# Altium project Inclinometer.PrjPcb
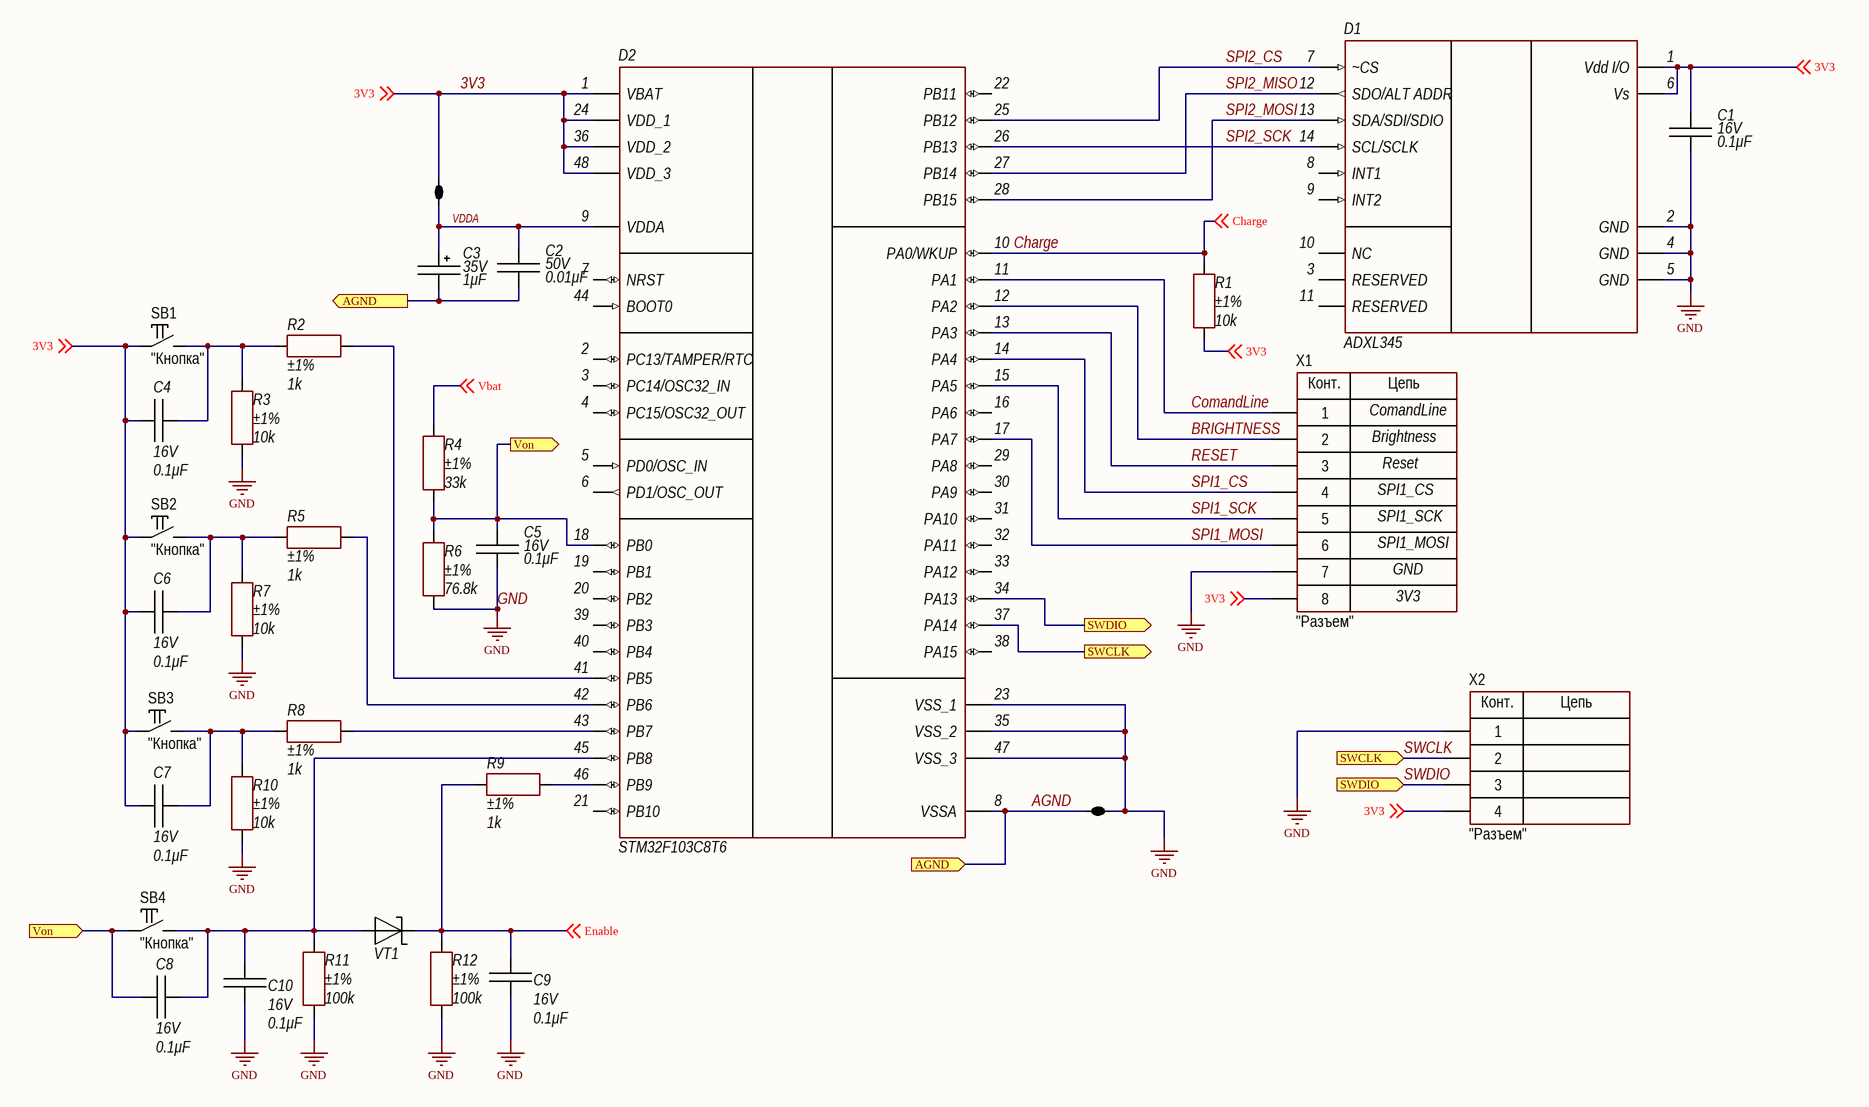
[diagram p0: InclinometerMain.SchDoc]
3 sheets, 52 parts. Net scope: flat (ports and power ports of the same name join across sheets).
Board file: Inclinometer.PcbDoc
Sheets:
  InclinometerMain.SchDoc
  InclinometerPower.SchDoc
  InclinometerDisplay.SchDoc

## Sheet InclinometerMain.SchDoc
size 420 x 297 mm; Address1: Address1; Address2: Address2; Address3: Address3; Address4: Address4; DocumentNumber: АБВГ.123456.001 Э3; SheetNumber: 1; Scale: 1:1; DocumentType: Схема электрическая принципиальная; FirstReferrence: АБВГ.123456.001

### Parts
C1  value 0.1μF  Voltage: 16V  [CAP: 0603]
C2  value 0.01μF  Voltage: 50V  [CAP: 0603]
C3  value 1μF  Voltage: 35V  [CAP: TANTAL-A]
C4  value 0.1μF  Voltage: 16V  [CAP: 0603]
C5  value 0.1μF  Voltage: 16V  [CAP: 0603]
C6  value 0.1μF  Voltage: 16V  [CAP: 0603]
C7  value 0.1μF  Voltage: 16V  [CAP: 0603]
C8  value 0.1μF  Voltage: 16V  [CAP: 0603]
C9  value 0.1μF  Voltage: 16V  [CAP: 0603]
C10  value 0.1μF  Voltage: 16V  [CAP: 0603]
D1  ADXL345  [ADXL345]
D2  STM32F103C8T6  [LQFP48]
J1  2 way net tie junction  [2way_MP]  (value not drawn)  (net tie, no BOM)
J2  2 way net tie junction  [2way_MP]  (value not drawn)  (net tie, no BOM)
R1  value 10k  Tolerance: ±1%  [RES: 0603]
R2  value 1k  Tolerance: ±1%  [RES: 0603]
R3  value 10k  Tolerance: ±1%  [RES: 0603]
R4  value 33k  Tolerance: ±1%  [RES: 0603]
R5  value 1k  Tolerance: ±1%  [RES: 0603]
R6  value 76.8k  Tolerance: ±1%  [RES: 0603]
R7  value 10k  Tolerance: ±1%  [RES: 0603]
R8  value 1k  Tolerance: ±1%  [RES: 0603]
R9  value 1k  Tolerance: ±1%  [RES: 0603]  (hidden comment: Resistor film, 2k, ±1%, 0603, 0.1W, -55...+155°C)
R10  value 10k  Tolerance: ±1%  [RES: 0603]
R11  value 100k  Tolerance: ±1%  [RES: 0603]  (hidden comment: Resistor film, 100k, ±5%, 0603, 0.1W, -55...+155°C)
R12  value 100k  Tolerance: ±1%  [RES: 0603]  (hidden comment: Resistor film, 1M, ±5%, 0603, 0.1W, -55...+155°C)
SB1  CommentText: "Кнопка"  [BUT: 6x6]
SB2  CommentText: "Кнопка"  [BUT: 6x6]
SB3  CommentText: "Кнопка"  [BUT: 6x6]
SB4  CommentText: "Кнопка"  [BUT: 6x6]
VT1  MOSFET P-channel transistor, -20V, -2.8A, 7.7nC, 4.16W, 58mOhm, 744pF, SOT23, -55...+150°C  [SOT23]  (value not drawn)
X1  CommentText: "Разъем"  [CON: PBS-8]
X2  CommentText: "Разъем"  [CON: PLS-4]

### Ports
AGND (in), AGND (out), SWCLK (in), SWCLK (out), SWDIO (in), SWDIO (out), Von (in), Von (out)

### Nets
GND: C1.1 C5.1 C9.1 C10.1 D1.2(GND) D1.4(GND) D1.5(GND) D2.23(VSS_1) D2.35(VSS_2) D2.47(VSS_3) J2.2 R3.1 R6.1 R7.1 R10.1 R11.2 R12.1 X1.7 X2.1
3V3: C1.2 C4.1 C6.1 C7.1 D1.1(Vdd_I/O) D1.6(Vs) D2.1(VBAT) D2.24(VDD_1) D2.36(VDD_2) D2.48(VDD_3) J1.1 R1.1 SB1.1 SB2.1 SB3.1 X1.8 X2.4 ; off-sheet 3V3
AGND: C2.1 C3.2 D2.8(VSSA) J2.1 ; port AGND
BRIGHTNESS: D2.12(PA2) X1.2
Charge: D2.10(PA0/WKUP) R1.2 ; off-sheet Charge
ComandLine: D2.11(PA1) X1.1
Enable: C9.2 R9.1 R12.2 VT1.3 ; off-sheet Enable
RESET: D2.13(PA3) X1.3
SPI1_CS: D2.14(PA4) X1.4
SPI1_MOSI: D2.17(PA7) X1.6
SPI1_SCK: D2.15(PA5) X1.5
SPI2_CS: D1.7(~CS) D2.25(PB12)
SPI2_MISO: D1.12(SDO/ALT_ADDR) D2.27(PB14)
SPI2_MOSI: D1.13(SDA/SDI/SDIO) D2.28(PB15)
SPI2_SCK: D1.14(SCL/SCLK) D2.26(PB13)
SWCLK: D2.37(PA14) X2.2 ; port SWCLK
SWDIO: D2.34(PA13) X2.3 ; port SWDIO
Vbat: R4.2 ; off-sheet Vbat
VDDA: C2.2 C3.1 D2.9(VDDA) J1.2
NetC4_2: C4.2 R2.1 R3.2 SB1.2
NetC5_2: C5.2 C8.1 D2.18(PB0) R4.1 R6.2 SB4.1 ; port Von
NetC6_2: C6.2 R5.1 R7.2 SB2.2
NetC7_2: C7.2 R8.1 R10.2 SB3.2
NetC8_2: C8.2 C10.2 D2.45(PB8) R11.1 SB4.2 VT1.1
NetD2_41: D2.41(PB5) R2.2
NetD2_42: D2.42(PB6) R5.2
NetD2_43: D2.43(PB7) R8.2
NetD2_46: D2.46(PB9) R9.2

Not connected (* = marked no-connect by the designer): D1 3(RESERVED) 8(INT1) 9(INT2) 10(NC) 11(RESERVED); D2 2(PC13/TAMPER/RTC) 3(PC14/OSC32_IN) 4(PC15/OSC32_OUT) 5(PD0/OSC_IN) 6(PD1/OSC_OUT) 7(NRST) 16(PA6) 19(PB1) 20(PB2) 21(PB10) 22(PB11) 29(PA8) 30(PA9) 31(PA10) 32(PA11) 33(PA12) 38(PA15) 39(PB3) 40(PB4) 44(BOOT0)

### Notes on the sheet
- ComandLine
- Brightness
- SPI1_CS
- Reset
- SPI1_SCK
- SPI1_MOSI
- GND
- 3V3
- Перв. примен.
- Справ. №
- Подп. и дата
- Инв. № дубл.
- Взам. инв. №
- Разраб.
- Изм.
- Лист
- № докум.
- Подп.
- Дата
- Лит.
- Масса
- Масштаб
- Пров.
- Т.контр.
- Листов
- Инв. № подл.
- Утв.
- Н.контр.
- 2.106-A3
- Копировал
- Формат А3
- (in symbol PBS-8) Конт.; Цепь
- (in symbol PLS-4) Конт.; Цепь

### Library data of the parts
C1 C4-C10 = Ceramic_0603: Manufacturer: Murata Electronics; PartNumber: GRM188R71C104KA01D; ValueManufacturerPartNumber: Ceramic capacitor, 0.1μF, X7R, ±10%, 16V, 0603, -55...+125°C; TypeCapacitor: Ceramic capacitor; Tolerance: ±10%; TypeDielectric: X7R; Package: 0603; HelpURL: https://www.digikey.com/product-detail/en/murata-electronics/GRM188R71C104KA01D/490-1532-2-ND/587060; Temperature: -55...+125°C
C2 = Ceramic_0603: Manufacturer: Murata Electronics; PartNumber: GRM188R71H103KA01D; ValueManufacturerPartNumber: Ceramic capacitor, 0.01μF, X7R, ±10%, 50V, 0603, -55...+125°C; TypeCapacitor: Ceramic capacitor; Tolerance: ±10%; TypeDielectric: X7R; Package: 0603; HelpURL: https://www.digikey.com/product-detail/en/murata-electronics/GRM188R71H103KA01D/490-1512-2-ND/587151; Temperature: -55...+125°C
C3 = Tantal_A: Manufacturer: AVX; PartNumber: TAJA105K035RNJ; ValueManufacturerPartNumber: Tantalum capacitor, 1μF, 35V, ±10%, 7.5Ohm, case A (3216), -55...+125°C; Impedance: 7.5Ohm; Tolerance: ±10%; TypeCapacitor: Tantalum capacitor; Package: case A (3216); HelpURL: https://www.digikey.com/product-detail/en/avx-corporation/TAJA105K035RNJ/478-1651-2-ND/563759; Temperature: -55...+125°C
D1 = ADXL345: Axlerometer sensor; Manufacture: Analog Device; Help URL: https://www.analog.com/media/en/technical-documentation/data-sheets/ADXL345.pdf; Case: СС-14-1; Model: ADXL345
D2 = STM32F103C8T6: 32bit microcontroller; Manufacture: ST; Case: LQFP48 (7x7mm); Model: STM32F103C8T6
J1 J2 = 2way: ComponentLink1URL: http://www.edatools.cz/addons; ComponentLink1Description: Source; FootprintNote: LP=12mil, MP=40mil, HP=120mil
R1 R3 R7 R10 = Resistor_0603: Manufacturer: Yageo; PartNumber: RC0603FR-0710KL; ValueManufacturerPartNumber: Resistor film, 10k, ±1%, 0603, 0.1W, -55...+155°C; TypeResistor: Resistor film; Power: 0.1W; Package: 0603; HelpURL: https://www.digikey.com/product-detail/en/yageo/RC0603FR-0710KL/311-10-0KHRCT-ND/729827; Temperature: -55...+155°C
R2 R5 R8 = Resistor_0603: Manufacturer: Yageo; PartNumber: RC0603FR-071KL; ValueManufacturerPartNumber: Resistor film, 1k, ±1%, 0603, 0.1W, -55...+155°C; TypeResistor: Resistor film; Power: 0.1W; Package: 0603; HelpURL: https://www.digikey.com/product-detail/en/yageo/RC0603FR-071KL/311-1-00KHRCT-ND/729790; Temperature: -55...+155°C
R4 = Resistor_0603: Manufacturer: Yageo; PartNumber: RC0603JR-0733KL; ValueManufacturerPartNumber: Resistor film, 33k, ±1%, 0603, 0.1W, -55...+155°C; TypeResistor: Resistor film; Power: 0.1W; Package: 0603; HelpURL: https://www.digikey.com/product-detail/en/yageo/RC0603FR-0720KL/311-20-0KHRCT-ND/729987; Temperature: -55...+155°C
R6 = Resistor_0603: Manufacturer: Yageo; PartNumber: RC0603FR-0776K8L; ValueManufacturerPartNumber: Resistor film, 76.8k, ±1%, 0603, 0.1W, -55...+155°C; TypeResistor: Resistor film; Power: 0.1W; Package: 0603; HelpURL: https://www.digikey.com/product-detail/en/yageo/RC0603FR-0710KL/311-10-0KHRCT-ND/729827; Temperature: -55...+155°C
R9 = Resistor_0603: Manufacturer: Yageo; PartNumber: RC0603FR-071KL; ValueManufacturerPartNumber: Resistor film, 1k, ±1%, 0603, 0.1W, -55...+155°C; Package: 0603; HelpURL: https://www.digikey.com/product-detail/en/yageo/RC0603FR-071KL/311-1-00KHRCT-ND/729790; Temperature: -55...+155°C; TypeResistor: Resistor film; Power: 0.1W
R11 R12 = Resistor_0603: Manufacturer: Yageo; PartNumber: RC0603FR-07100KL; ValueManufacturerPartNumber: Resistor film, 100k, ±1%, 0603, 0.1W, -55...+155°C; Package: 0603; HelpURL: https://www.digikey.com/product-detail/en/yageo/RC0603FR-0710KL/311-10-0KHRCT-ND/729827; Temperature: -55...+155°C; TypeResistor: Resistor film; Power: 0.1W
SB1-SB4 = Button_tactile: Manufacturer: TE Connectivity; ValueManufacturerPartNumber: Tactile button, 6x6mm; PartNumber: FSM2JSMAATR; TypeButton: Tactile button; HelpURL: https://www.digikey.com/product-detail/en/te-connectivity-alcoswitch-switches/FSM2JSMAATR/450-1792-1-ND/3503931; Package: 6x6mm
VT1 = BAT54.215: Schottky diode; Manufacture: Nexperia; Model: BAT54.215; Help URL: https://assets.nexperia.com/documents/data-sheet/BAT54_SER.pdf; Case: TO236/SOT23
X1 = PBS-8: Manufacturer: Connfly; ValueManufacturerPartNumber: Connector, 8pin, 2.54mm, 500VAC, 3A; TypeConnector: Connector; VoltageMax: 500VAC; Pitch: 2.54mm; CurrentMax: 3A; Multichannel: 8pin; HelpURL: https://www.chipdip.ru/product/pbs-8; PartNumber: PBS-8
X2 = PLS-4: Manufacturer: Connfly; ValueManufacturerPartNumber: Connector, 4pin, 2.54mm, 500VAC, 3A; TypeConnector: Connector; VoltageMax: 500VAC; Pitch: 2.54mm; CurrentMax: 3A; Multichannel: 4pin; HelpURL: https://www.chipdip.ru/product/pls-4; PartNumber: PLS-4

## Sheet InclinometerPower.SchDoc
size 420 x 297 mm; Address1: Address1; Address2: Address2; Address3: Address3; Address4: Address4; DocumentNumber: АБВГ.123456.001 Э3; SheetNumber: 1; Scale: 1:1; DocumentType: Схема электрическая принципиальная; FirstReferrence: АБВГ.123456.001
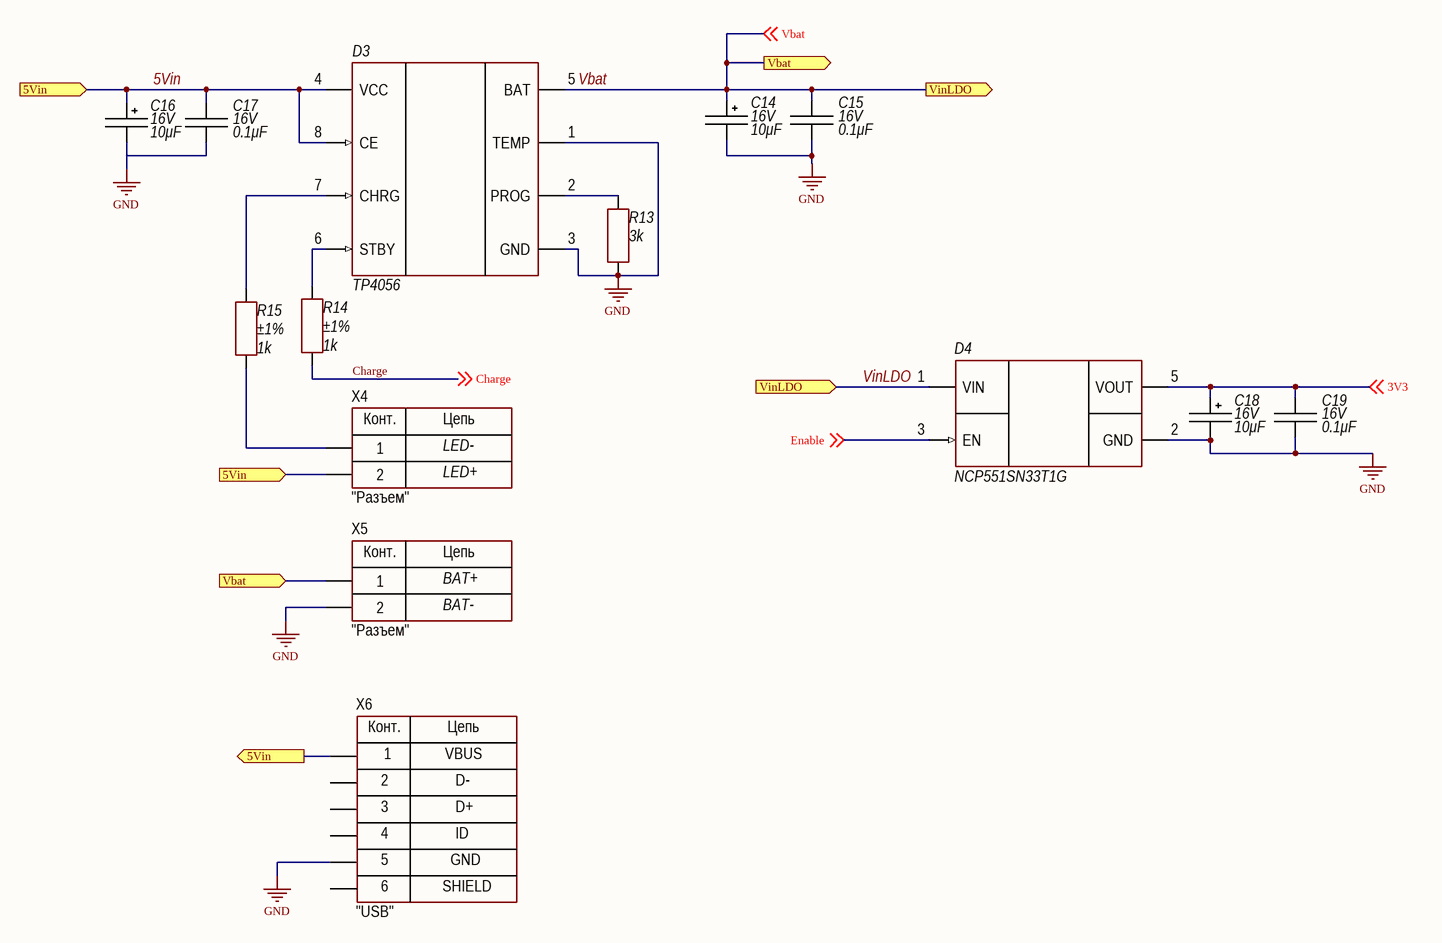
[diagram p1: InclinometerPower.SchDoc]

### Parts
C14  value 10μF  Voltage: 16V  [CAP: TANTAL-A]
C15  value 0.1μF  Voltage: 16V  [CAP: 0603]
C16  value 10μF  Voltage: 16V  [CAP: TANTAL-A]
C17  value 0.1μF  Voltage: 16V  [CAP: 0603]
C18  value 10μF  Voltage: 16V  [CAP: TANTAL-A]
C19  value 0.1μF  Voltage: 16V  [CAP: 0603]
D3  (no value)  [SOP8]
D4  (no value)  [5-TSOP]
R13  value 3k  [RES: 0603]
R14  value 1k  Tolerance: ±1%  [RES: 0603]  (hidden comment: Resistor film, 2k, ±1%, 0603, 0.1W, -55...+155°C)
R15  value 1k  Tolerance: ±1%  [RES: 0603]
X4  CommentText: "Разъем"  [CON: PLS-2]
X5  CommentText: "Разъем"  [CON: PLS-2]
X6  CommentText: "USB"  [CON: USB micro-A (ZX62-B-5PA)]

### Ports
5Vin (in), 5Vin (out), Vbat (in), Vbat (out), VinLDO (in), VinLDO (out)

### Nets
GND: C14.2 C15.1 C16.2 C17.1 C18.2 C19.1 D3.1(TEMP) D3.3(GND) D4.2(GND) R13.1 X5.2 X6.5
3V3: C18.1 C19.2 D4.5(VOUT) ; off-sheet 3V3
5Vin: C16.1 C17.2 D3.4(VCC) D3.8(CE) X4.2 X6.1 ; port 5Vin
Charge: R14.1 ; off-sheet Charge
Enable: D4.3(EN) ; off-sheet Enable
Vbat: C14.1 C15.2 D3.5(BAT) D4.1(VIN) X5.1 ; off-sheet Vbat, port VinLDO, port Vbat  [also labelled VinLDO]
NetD3_2: D3.2(PROG) R13.2
NetD3_6: D3.6(STBY) R14.2
NetD3_7: D3.7(CHRG) R15.2
NetR15_1: R15.1 X4.1

Not connected (* = marked no-connect by the designer): X6 0 2 3 4

### Notes on the sheet
- LED-
- LED+
- BAT+
- BAT-
- Перв. примен.
- Справ. №
- Подп. и дата
- Инв. № дубл.
- Взам. инв. №
- Разраб.
- Изм.
- Лист
- № докум.
- Подп.
- Дата
- Лит.
- Масса
- Масштаб
- Пров.
- Т.контр.
- Листов
- Инв. № подл.
- Утв.
- Н.контр.
- 2.106-A3
- Копировал
- Формат А3
- (in symbol Connector_USB_micro_B) Конт.; Цепь; VBUS; D-; D+; ID; GND; 6; SHIELD
- (in symbol PLS-2) Конт.; Цепь

### Library data of the parts
C14 C16 C18 = Tantal_A: Manufacturer: AVX; PartNumber: TAJA106K016RNJ; ValueManufacturerPartNumber: Tantalum capacitor, 10μF, 16V, ±10%, 3Ohm, case A (3216), -55...+125°C; Impedance: 3Ohm; Tolerance: ±10%; TypeCapacitor: Tantalum capacitor; Package: case A (3216); HelpURL: https://www.digikey.com/product-detail/en/avx-corporation/TAJA106K016RNJ/478-1655-1-ND/564687; Temperature: -55...+125°C
C15 C17 C19 = Ceramic_0603: as C1 on sheet InclinometerMain; Package: 0603; HelpURL: https://www.digikey.com/product-detail/en/murata-electronics/GRM188R71C104KA01D/490-1532-2-ND/587060; Temperature: -55...+125°C
D3 = TP4056: Linear Li-lon Battery Charger; Manufacturer: Top Power; CurrentOutput: 1A; ComponentType: Linear Li-lon Battery Charger; HelpURL: https://www.chipdip.ru/product/tp4056; Package: SOP-8; Temperature: -40...+85°C; ValueManufacturerPartNumber: =ComponentType+', '+VoltageInput+', '+MaxDropout+', '+VoltageOutput+', '+CurrentOutput+', '+Temperature+', '+Package; PartNumber: TP4056
D4 = NCP551SN33T1G: Linear voltage regulator; Manufacturer: ON Semiconductor; ValueManufacturerPartNumber: Linear voltage regulator, input 0...12V, 0.25V, output 3.3V, 150mA, -40...+85°C, TSOP-5; CurrentOutput: 150mA; MaxDropout: 0.25V; VoltageInput: input 0...12V; VoltageOutput: output 3.3V; ComponentType: Linear voltage regulator; HelpURL: https://www.digikey.com/en/products/detail/onsemi/NCP551SN33T1G/13511773; Package: TSOP-5; Temperature: -40...+85°C; PartNumber: NCP551SN33T1G
R13 = Resistor_0603: Manufacturer: Yageo; PartNumber: RC0603FR-073KL; ValueManufacturerPartNumber: Resistor film, 3k, ±1%, 0603, 0.1W, -55...+155°C; TypeResistor: Resistor film; Power: 0.1W; Tolerance: ±1%; Package: 0603; HelpURL: https://www.digikey.com/product-detail/en/yageo/RC0603FR-071KL/311-1-00KHRCT-ND/729790; Temperature: -55...+155°C
R14 = Resistor_0603: as R9 on sheet InclinometerMain; Package: 0603; HelpURL: https://www.digikey.com/product-detail/en/yageo/RC0603FR-071KL/311-1-00KHRCT-ND/729790; Temperature: -55...+155°C; TypeResistor: Resistor film; Power: 0.1W
R15 = Resistor_0603: as R2 on sheet InclinometerMain; Package: 0603; HelpURL: https://www.digikey.com/product-detail/en/yageo/RC0603FR-071KL/311-1-00KHRCT-ND/729790; Temperature: -55...+155°C
X4 X5 = PLS-2: Manufacturer: Connfly; ValueManufacturerPartNumber: Connector, 2pin, 2.54mm, 500VAC, 3A; TypeConnector: Connector; VoltageMax: 500VAC; Pitch: 2.54mm; CurrentMax: 3A; Multichannel: 2pin; HelpURL: https://www.chipdip.ru/product/pls-2; PartNumber: PLS-2
X6 = Connector_USB_micro_B: Manufacturer: Hirose Electric; ValueManufacturerPartNumber: USB micro B; PartNumber: ZX62-B-5PA; HelpURL: https://www.digikey.com/product-detail/en/hirose-electric-co-ltd/ZX62-B-5PA/H11579CT-ND/1851090; TypeConnector: USB micro B

## Sheet InclinometerDisplay.SchDoc
size 420 x 297 mm; Address1: Address1; Address2: Address2; Address3: Address3; Address4: Address4; DocumentNumber: АБВГ.123456.001 Э3; SheetNumber: 1; Scale: 1:1; DocumentType: Схема электрическая принципиальная; FirstReferrence: АБВГ.123456.001
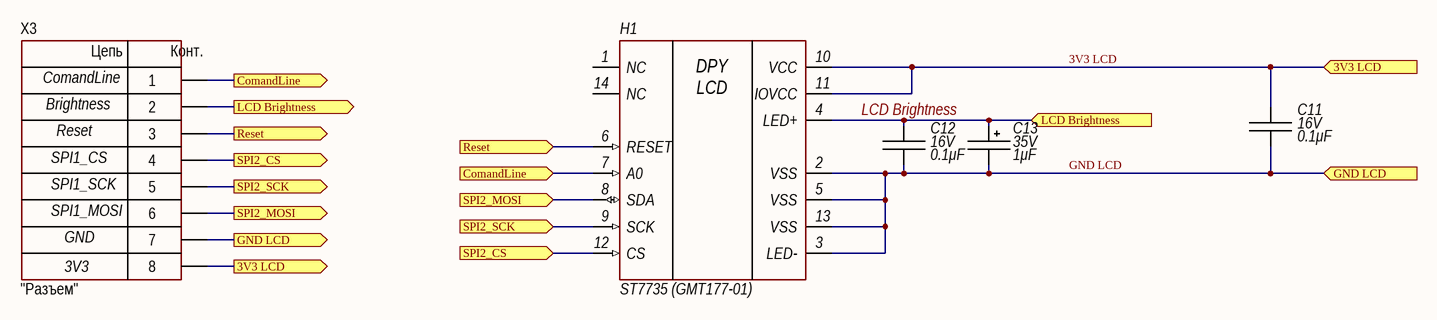
[diagram p2: InclinometerDisplay.SchDoc]

### Parts
C11  value 0.1μF  Voltage: 16V  [CAP: 0603]
C12  value 0.1μF  Voltage: 16V  [CAP: 0603]
C13  value 1μF  Voltage: 35V  [CAP: TANTAL-A]
H1  ST7735 (GMT177-01)  [ST7735 DISPLAY]
X3  CommentText: "Разъем"  [CON: PLS-8]

### Ports
3V3 LCD (in), 3V3 LCD (out), ComandLine (in), ComandLine (out), GND LCD (in), GND LCD (out), LCD Brightness (in), LCD Brightness (out), Reset (in), Reset (out), SPI2_CS (in), SPI2_CS (out), SPI2_MOSI (in), SPI2_MOSI (out), SPI2_SCK (in), SPI2_SCK (out)

### Nets
3V3 LCD: C11.2 H1.10(VCC) H1.11(IOVCC) X3.8 ; port 3V3 LCD
GND LCD: C11.1 C12.1 C13.2 H1.2(VSS) H1.3(LED-) H1.5(VSS) H1.13(VSS) X3.7 ; port GND LCD
LCD Brightness: C12.2 C13.1 H1.4(LED+) X3.2 ; port LCD Brightness
NetH1_6: H1.6(RESET) X3.3 ; port Reset
NetH1_7: H1.7(A0) X3.1 ; port ComandLine
NetH1_8: H1.8(SDA) X3.6 ; port SPI2_MOSI
NetH1_9: H1.9(SCK) X3.5 ; port SPI2_SCK
NetH1_12: H1.12(CS) X3.4 ; port SPI2_CS

Not connected (* = marked no-connect by the designer): H1 1(NC) 14(NC)

### Notes on the sheet
- (near X3) ComandLine
- (near X3) Brightness
- SPI1_CS
- SPI1_SCK
- Reset
- (near X3) SPI1_MOSI
- GND
- 3V3
- Перв. примен.
- Справ. №
- Подп. и дата
- Инв. № дубл.
- Взам. инв. №
- Разраб.
- Изм.
- Лист
- № докум.
- Подп.
- Дата
- Лит.
- Масса
- Масштаб
- Пров.
- Т.контр.
- Листов
- Инв. № подл.
- Утв.
- Н.контр.
- 2.106-A3
- Копировал
- Формат А3
- (in symbol PLS-8) Цепь; Конт.
- (in symbol ST7735 DISPLAY) DPY / LCD

### Library data of the parts
C11 C12 = Ceramic_0603: as C1 on sheet InclinometerMain; Package: 0603; HelpURL: https://www.digikey.com/product-detail/en/murata-electronics/GRM188R71C104KA01D/490-1532-2-ND/587060; Temperature: -55...+125°C
C13 = Tantal_A: as C3 on sheet InclinometerMain; Package: case A (3216); HelpURL: https://www.digikey.com/product-detail/en/avx-corporation/TAJA105K035RNJ/478-1651-2-ND/563759; Temperature: -55...+125°C
H1 = ST7735 DISPLAY: Manufacture: Sitronix; Model: ST7735 (GMT177-01); Help URL: https://pdf1.alldatasheetru.com/datasheet-pdf/view/326213/SITRONIX/ST7735.html
X3 = PLS-8: Manufacturer: Connfly; ValueManufacturerPartNumber: Connector, 8pin, 2.54mm, 500VAC, 3A; TypeConnector: Connector; VoltageMax: 500VAC; Pitch: 2.54mm; CurrentMax: 3A; Multichannel: 8pin; HelpURL: https://www.chipdip.ru/product/pls-8-ds1021-1-8sf112; PartNumber: PLS-8

## Nets that join several sheets
GND: InclinometerMain (19 pins), InclinometerPower (12 pins)
3V3: InclinometerMain (17 pins), InclinometerPower (C18.1 C19.2 D4.5)
Charge: InclinometerMain (D2.10 R1.2), InclinometerPower (R14.1)
Enable: InclinometerMain (C9.2 R9.1 R12.2 VT1.3), InclinometerPower (D4.3)
Vbat: InclinometerMain (R4.2), InclinometerPower (5 pins)